# EAGLE schematic 5vdualsupply_sai (EAGLE 9.6.2)
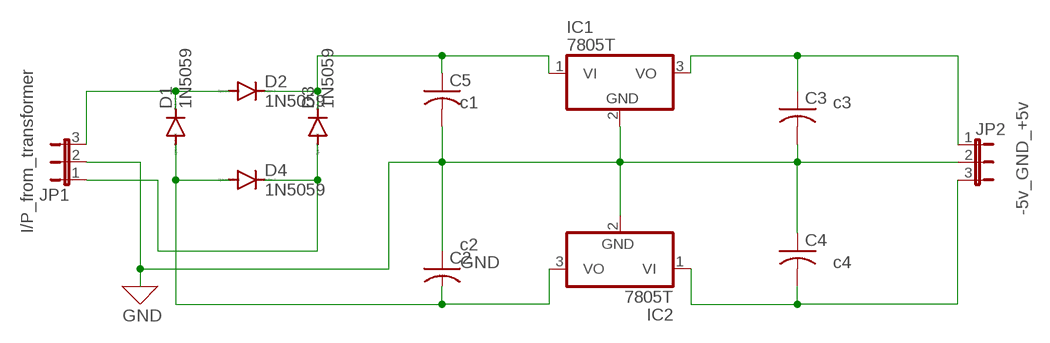
[diagram p0: schematic, sheet 1]

## Parts
C2  C-US025-024X044  [C025-024X044]
C3  C-US025-024X044  [C025-024X044]
C4  C-US025-024X044  [C025-024X044]
C5  C-US025-024X044  [C025-024X044]
D1  1N5059  [DO204-10]
D2  1N5059  [DO204-10]
D3  1N5059  [DO204-10]
D4  1N5059  [DO204-10]
IC1  7805T  [TO220H]
IC2  7805T  [TO220H]
JP1  JP2W  [JP2W]
JP2  JP2W  [JP2W]

## Nets
GND: C2.1 C3.2 C4.1 C5.2 IC1.2(GND) IC2.2(GND) JP1.2 JP2.2
N$1: D3.A D4.C JP1.1
N$2: C2.2 D1.A D4.A IC2.3(VO)
N$3: D1.C D2.A JP1.3
N$4: C3.1 IC1.3(VO) JP2.1
N$5: C5.1 D2.C D3.C IC1.1(VI)
N$7: C4.2 IC2.1(VI) JP2.3

## Notes on the sheet
- c1 | c3
- -5v_GND_+5v
- I/P_from_transformer
- c2
- c4

## Library data of the parts
C2-C5 = rcl:C-US: CAPACITOR, American symbol; SPICEPREFIX: C
D1-D4 = diode:1N5059: DIODE controlled avalanche rectifier
IC1 IC2 = linear:78*: Positive VOLTAGE REGULATOR Source: http://cache.national.com/ds/LM/LM78L05.pdf http://www.fairchildsemi.com/ds/LM/LM7805.pdf
JP1 JP2 = jumper:JP2W: JUMPER